# Altium schematic sheet RTC.SchDoc
size A; SheetNumber: 9; SheetTotal: 15
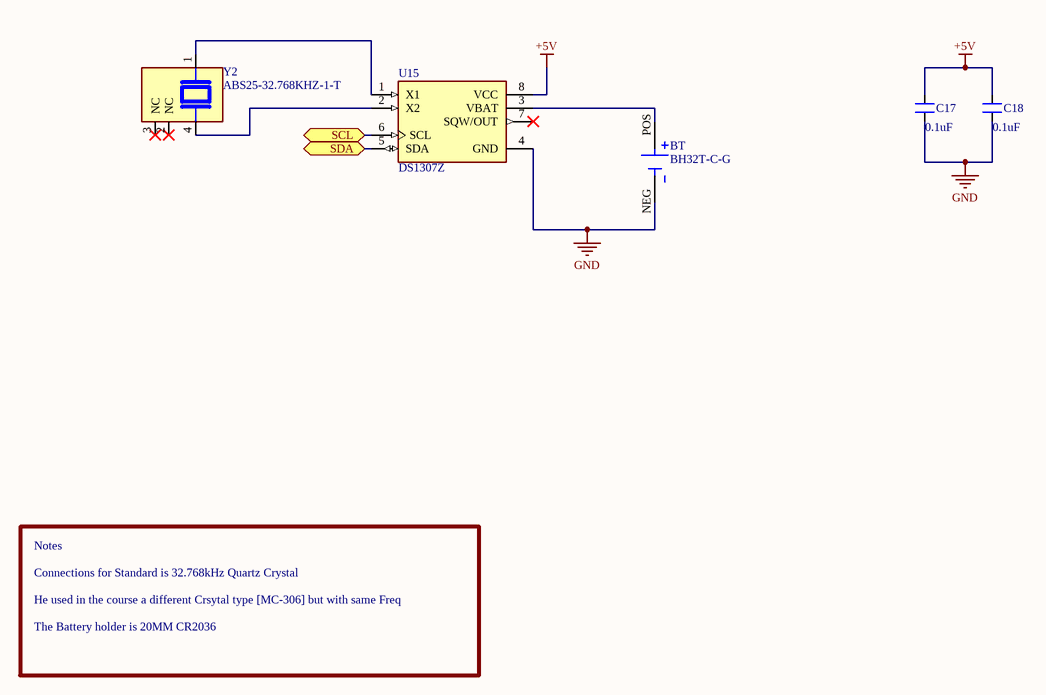
[diagram p0: RTC.SchDoc]

## Parts
BT  BH32T-C-G  [BAT_BH32T-C-G]
C17  0.1uF  [CAP_0805]
C18  0.1uF  [CAP_0805]
U15  DS1307Z  [SOIC127P600X175-8N]
Y2  ABS25-32.768KHZ-1-T  [XTAL_ABS25-32.768KHZ-1-T]

## Ports
SCL (bidir, see Block Diagram[5D], 4-20mA Sensor[4B], ATMEGA2560-16AU[1C]), SDA (bidir, see Block Diagram[5D], 4-20mA Sensor[4B], ATMEGA2560-16AU[1C])

## Nets
+5V: C17.2 C18.2 U15.8(VCC)
GND: BT.NEG C17.1 C18.1 U15.4(GND)
SCL: U15.6(SCL) ; port SCL
SDA: U15.5(SDA) ; port SDA
NetBT_POS: BT.POS U15.3(VBAT)
NetU15_1: U15.1(X1) Y2.1
NetU15_2: U15.2(X2) Y2.4

Not connected (* = marked no-connect by the designer): U15 7(SQW/OUT)*; Y2 2(NC)* 3(NC)*

## Notes on the sheet
- Notes
- Connections for Standard is 32.768kHz Quartz Crystal
- He used in the course a different Crsytal type [MC-306] but with same Freq
- The Battery holder is 20MM CR2036

## Library data of the parts
BT = BH32T-C-G: BATTERY HOLDER COIN 20MM PC PIN; MF: MPD; Value: *; Availability: Unavailable; SnapEDA_Link: https://www.snapeda.com/parts/BH32T-C-G/Memory%20Protection%20Devices/view-part/4219673/?ref=snap; Package: None; MP: BH32T-C-G; Price: None
C17 C18 = CAP_0.1uF-50V-5%-0805: 0.1µF ±5% 50V Ceramic Capacitor X7R 0805 (2012 Metric); Manufacturer: AVX Corporation; Manufacturer Part Number: 08055C104JAT4A; Alternate Part Number-1: 0805B104M500; Case/Package: 0805; Supplier-1: SIRICOM; Supplier Part Number-1: 0805B104J500CT
U15 = DS1307Z: Real Time Clock _RTC_ IC Clock/Calendar 56B IÂ²C, 2-Wire Serial 8-SOIC _0.154, 3.90mm Width_; MF: Maxim Integrated; Availability: Unavailable; Price: None; Package: SO-8 Maxim Integrated; Value: *; SnapEDA_Link: https://www.snapeda.com/parts/DS1307Z/Maxim%20Integrated/view-part/524266/?ref=snap; MP: DS1307Z
Y2 = ABS25-32.768KHZ-1-T: 32.768 kHz Â±10ppm Crystal 12.5pF 50 kOhms 4-SOJ, 5.50mm pitch; MF: Abracon LLC; Price: None; Purchase-URL: https://pricing.snapeda.com/search/part/ABS25-32.768KHZ-1-T/?ref=eda; Package: 4-4 Abracon; Check_prices: https://www.snapeda.com/parts/ABS25-32.768KHZ-1-T/Abracon+LLC/view-part/?ref=eda; Value: *; MP: ABS25-32.768KHZ-1-T; Availability: In Stock; SnapEDA_Link: https://www.snapeda.com/parts/ABS25-32.768KHZ-1-T/Abracon+LLC/view-part/?ref=snap